# EAGLE design midicontroller (EAGLE 7.0.0)
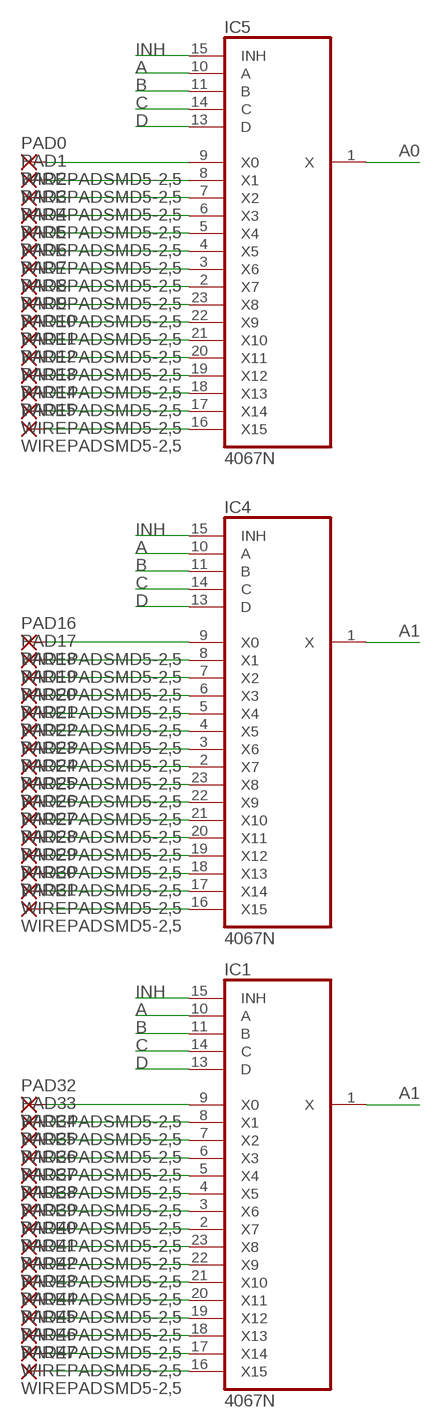
[diagram p0: schematic, sheet 1]

## Parts
IC1  4067N  [DIL24-6]
IC4  4067N  [DIL24-6]
IC5  4067N  [DIL24-6]
PAD0  WIREPADSMD5-2,5  [5-2,5]
PAD1  WIREPADSMD5-2,5  [5-2,5]
PAD2  WIREPADSMD5-2,5  [5-2,5]
PAD3  WIREPADSMD5-2,5  [5-2,5]
PAD4  WIREPADSMD5-2,5  [5-2,5]
PAD5  WIREPADSMD5-2,5  [5-2,5]
PAD6  WIREPADSMD5-2,5  [5-2,5]
PAD7  WIREPADSMD5-2,5  [5-2,5]
PAD8  WIREPADSMD5-2,5  [5-2,5]
PAD9  WIREPADSMD5-2,5  [5-2,5]
PAD10  WIREPADSMD5-2,5  [5-2,5]
PAD11  WIREPADSMD5-2,5  [5-2,5]
PAD12  WIREPADSMD5-2,5  [5-2,5]
PAD13  WIREPADSMD5-2,5  [5-2,5]
PAD14  WIREPADSMD5-2,5  [5-2,5]
PAD15  WIREPADSMD5-2,5  [5-2,5]
PAD16  WIREPADSMD5-2,5  [5-2,5]
PAD17  WIREPADSMD5-2,5  [5-2,5]
PAD18  WIREPADSMD5-2,5  [5-2,5]
PAD19  WIREPADSMD5-2,5  [5-2,5]
PAD20  WIREPADSMD5-2,5  [5-2,5]
PAD21  WIREPADSMD5-2,5  [5-2,5]
PAD22  WIREPADSMD5-2,5  [5-2,5]
PAD23  WIREPADSMD5-2,5  [5-2,5]
PAD24  WIREPADSMD5-2,5  [5-2,5]
PAD25  WIREPADSMD5-2,5  [5-2,5]
PAD26  WIREPADSMD5-2,5  [5-2,5]
PAD27  WIREPADSMD5-2,5  [5-2,5]
PAD28  WIREPADSMD5-2,5  [5-2,5]
PAD29  WIREPADSMD5-2,5  [5-2,5]
PAD30  WIREPADSMD5-2,5  [5-2,5]
PAD31  WIREPADSMD5-2,5  [5-2,5]
PAD32  WIREPADSMD5-2,5  [5-2,5]
PAD33  WIREPADSMD5-2,5  [5-2,5]
PAD34  WIREPADSMD5-2,5  [5-2,5]
PAD35  WIREPADSMD5-2,5  [5-2,5]
PAD36  WIREPADSMD5-2,5  [5-2,5]
PAD37  WIREPADSMD5-2,5  [5-2,5]
PAD38  WIREPADSMD5-2,5  [5-2,5]
PAD39  WIREPADSMD5-2,5  [5-2,5]
PAD40  WIREPADSMD5-2,5  [5-2,5]
PAD41  WIREPADSMD5-2,5  [5-2,5]
PAD42  WIREPADSMD5-2,5  [5-2,5]
PAD43  WIREPADSMD5-2,5  [5-2,5]
PAD44  WIREPADSMD5-2,5  [5-2,5]
PAD45  WIREPADSMD5-2,5  [5-2,5]
PAD46  WIREPADSMD5-2,5  [5-2,5]
PAD47  WIREPADSMD5-2,5  [5-2,5]

## Nets
A: IC1.10(A) IC4.10(A) IC5.10(A)
A0: IC5.1(X)
A1: IC1.1(X) IC4.1(X)
B: IC1.11(B) IC4.11(B) IC5.11(B)
C: IC1.14(C) IC4.14(C) IC5.14(C)
D: IC1.13(D) IC4.13(D) IC5.13(D)
INH: IC1.15(INH) IC4.15(INH) IC5.15(INH)
N$1: IC5.8(X1) PAD1.1(P)
N$2: IC5.7(X2) PAD2.1(P)
N$3: IC5.6(X3) PAD3.1(P)
N$4: IC5.5(X4) PAD4.1(P)
N$5: IC5.4(X5) PAD5.1(P)
N$6: IC5.3(X6) PAD6.1(P)
N$7: IC5.2(X7) PAD7.1(P)
N$8: IC5.23(X8) PAD8.1(P)
N$9: IC5.22(X9) PAD9.1(P)
N$10: IC5.21(X10) PAD10.1(P)
N$11: IC5.20(X11) PAD11.1(P)
N$12: IC5.19(X12) PAD12.1(P)
N$13: IC5.18(X13) PAD13.1(P)
N$14: IC5.17(X14) PAD14.1(P)
N$15: IC5.16(X15) PAD15.1(P)
N$16: IC4.9(X0) PAD16.1(P)
N$17: IC4.8(X1) PAD17.1(P)
N$18: IC4.7(X2) PAD18.1(P)
N$19: IC4.6(X3) PAD19.1(P)
N$20: IC4.5(X4) PAD20.1(P)
N$21: IC4.4(X5) PAD21.1(P)
N$22: IC4.3(X6) PAD22.1(P)
N$23: IC4.2(X7) PAD23.1(P)
N$24: IC4.23(X8) PAD24.1(P)
N$25: IC4.22(X9) PAD25.1(P)
N$26: IC4.21(X10) PAD26.1(P)
N$27: IC4.20(X11) PAD27.1(P)
N$28: IC4.19(X12) PAD28.1(P)
N$29: IC4.18(X13) PAD29.1(P)
N$30: IC4.17(X14) PAD30.1(P)
N$31: IC4.16(X15) PAD31.1(P)
N$32: IC1.9(X0) PAD32.1(P)
N$33: IC1.8(X1) PAD33.1(P)
N$34: IC1.7(X2) PAD34.1(P)
N$35: IC1.6(X3) PAD35.1(P)
N$36: IC1.5(X4) PAD36.1(P)
N$37: IC1.4(X5) PAD37.1(P)
N$38: IC1.3(X6) PAD38.1(P)
N$39: IC1.2(X7) PAD39.1(P)
N$40: IC1.23(X8) PAD40.1(P)
N$41: IC1.22(X9) PAD41.1(P)
N$42: IC1.21(X10) PAD42.1(P)
N$43: IC1.20(X11) PAD43.1(P)
N$44: IC1.19(X12) PAD44.1(P)
N$45: IC1.18(X13) PAD45.1(P)
N$46: IC1.17(X14) PAD46.1(P)
N$47: IC1.16(X15) PAD47.1(P)
N$79: IC5.9(X0) PAD0.1(P)

## Power pins joined to a net without a drawn wire
VDD: IC1.24(VDD) IC4.24(VDD) IC5.24(VDD)
VSS: IC1.12(VSS) IC4.12(VSS) IC5.12(VSS)

## Library data of the parts
IC1 IC4 IC5 = 40xx:4067: 16-channel ANALOG MULTIPLEXER
PAD0 PAD1-PAD47 = wirepad:WIREPAD: Wire PAD connect wire on PCB

## Board
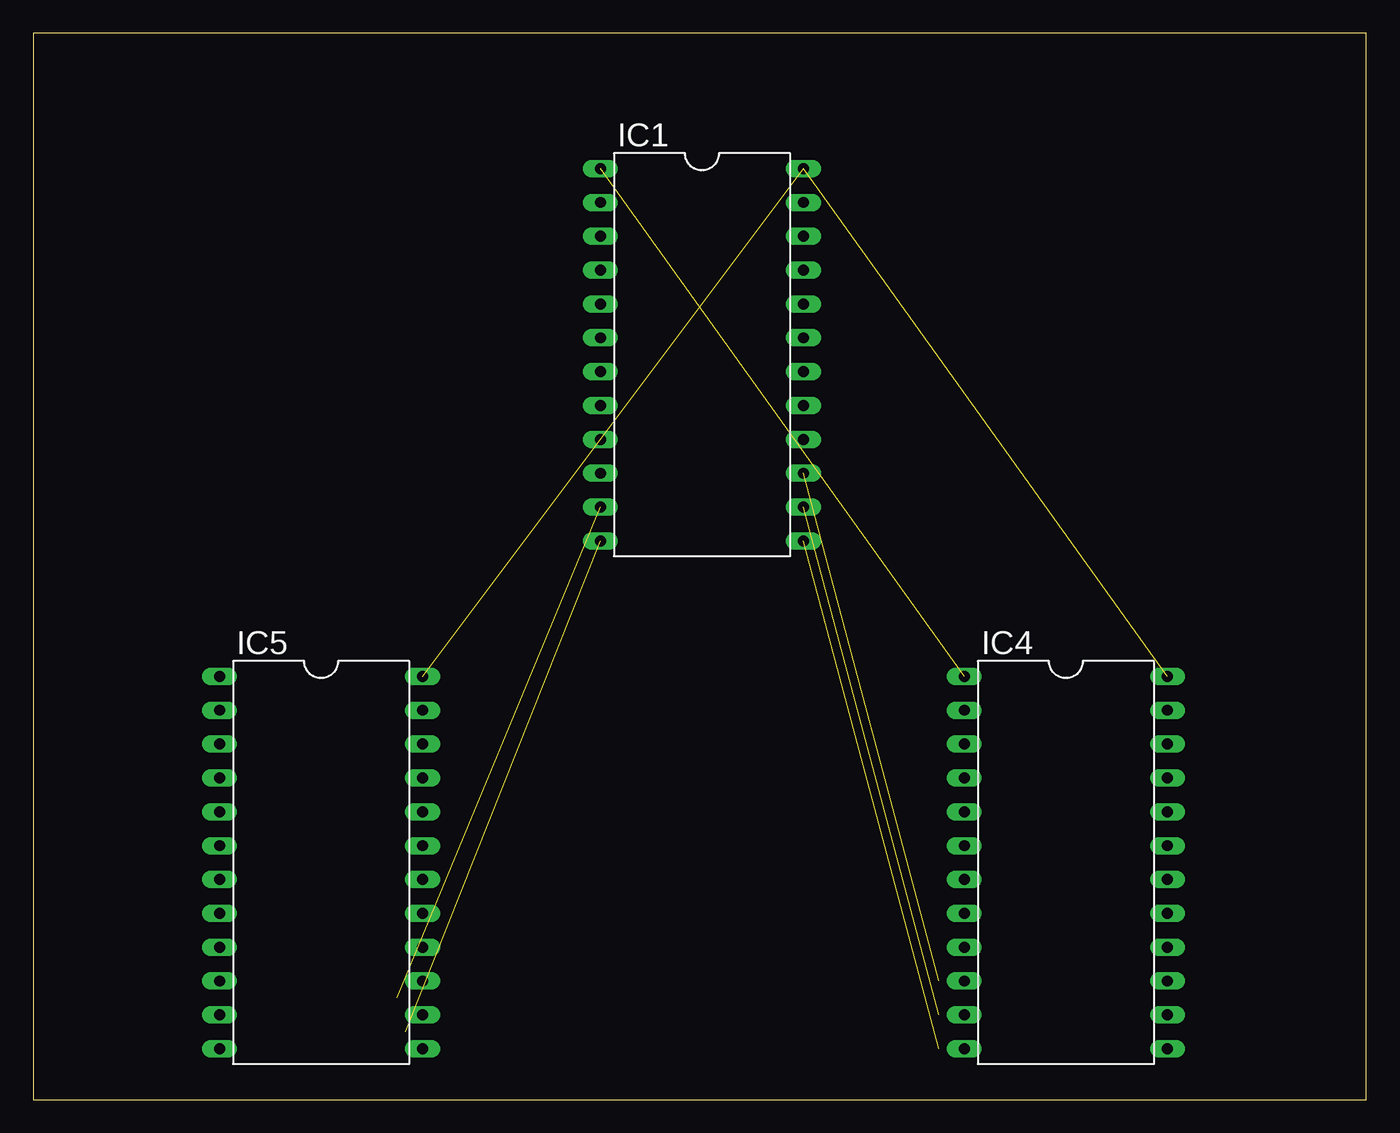
[diagram p1: board, top side]
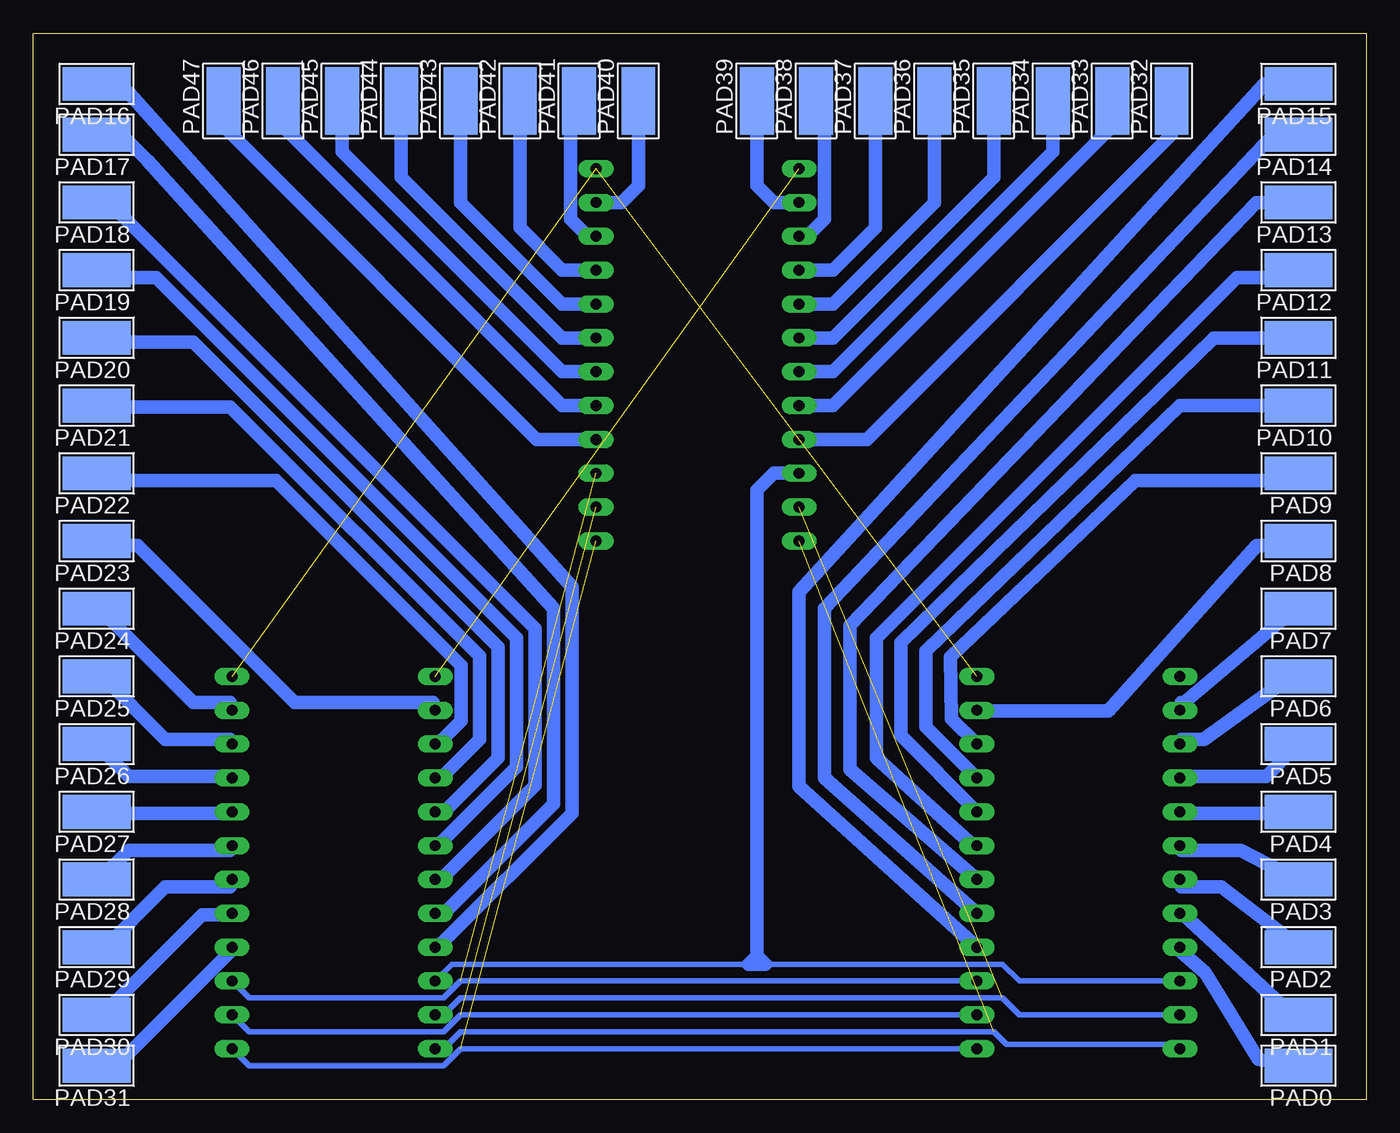
[diagram p2: board, bottom side, seen from below]

Size 100 x 80 mm. Coordinates in mm from the lower left corner, seen from the top.
Outline: 0,0 100,0 100,80 0,80 0,0
Copper layers (1*16): Top 0.035mm / dielectric 1.5mm / Bottom 0.035mm
Design rules "Tkkrlab-CNC": minimum track width 8mil, minimum drill 0.7mm, track to track 0.37mm, track to pad 0.37mm, pad to pad 0.37mm, via to via 0.37mm, smd to smd 0.37mm, copper to edge 20mil, drill to drill 8mil, minimum pad ring 10mil, minimum via ring 8mil, stop-mask expansion 4mil, vias tented up to drill 0mil, thermal gap 10mil

### Footprints (pad centres in the part's own frame; a part is rotated, then mirrored left to right if it is on the bottom)
DIL24-6 = drill 0.813 long: 1 -13.97,-7.62; 2 -11.43,-7.62; 3 -8.89,-7.62; 4 -6.35,-7.62; 5 -3.81,-7.62; 6 -1.27,-7.62; 7 1.27,-7.62; 8 3.81,-7.62; 9 6.35,-7.62; 10 8.89,-7.62; 11 11.43,-7.62; 12 13.97,-7.62; 13 13.97,7.62; 14 11.43,7.62; 15 8.89,7.62; 16 6.35,7.62; 17 3.81,7.62; 18 1.27,7.62; 19 -1.27,7.62; 20 -3.81,7.62; 21 -6.35,7.62; 22 -8.89,7.62; 23 -11.43,7.62; 24 -13.97,7.62
5-2,5 = smd 2.54 x 5.08: 1 0,0

### Placement (x,y rotation side)
IC1  50.16,55.88 270 top
IC4  77.47,17.78 270 top
IC5  21.59,17.78 270 top
PAD0  5.08,2.54 90 bottom
PAD1  5.08,6.35 90 bottom
PAD2  5.08,11.43 90 bottom
PAD3  5.08,16.51 90 bottom
PAD4  5.08,21.59 90 bottom
PAD5  5.08,26.67 90 bottom
PAD6  5.08,31.75 90 bottom
PAD7  5.08,36.83 90 bottom
PAD8  5.08,41.91 90 bottom
PAD9  5.08,46.99 90 bottom
PAD10  5.08,52.07 90 bottom
PAD11  5.08,57.15 90 bottom
PAD12  5.08,62.23 90 bottom
PAD13  5.08,67.31 90 bottom
PAD14  5.08,72.39 90 bottom
PAD15  5.08,76.2 90 bottom
PAD16  95.25,76.2 90 bottom
PAD17  95.25,72.39 90 bottom
PAD18  95.25,67.31 90 bottom
PAD19  95.25,62.23 90 bottom
PAD20  95.25,57.15 90 bottom
PAD21  95.25,52.07 90 bottom
PAD22  95.25,46.99 90 bottom
PAD23  95.25,41.91 90 bottom
PAD24  95.25,36.83 90 bottom
PAD25  95.25,31.75 90 bottom
PAD26  95.25,26.67 90 bottom
PAD27  95.25,21.59 90 bottom
PAD28  95.25,16.51 90 bottom
PAD29  95.25,11.43 90 bottom
PAD30  95.25,6.35 90 bottom
PAD31  95.25,2.54 90 bottom
PAD32  14.61,74.93 0 bottom
PAD33  19.05,74.93 0 bottom
PAD34  23.5,74.93 0 bottom
PAD35  27.94,74.93 0 bottom
PAD36  32.38,74.93 0 bottom
PAD37  36.83,74.93 0 bottom
PAD38  41.27,74.93 0 bottom
PAD39  45.72,74.93 0 bottom
PAD40  54.61,74.93 0 bottom
PAD41  59.05,74.93 0 bottom
PAD42  63.5,74.93 0 bottom
PAD43  67.94,74.93 0 bottom
PAD44  72.39,74.93 0 bottom
PAD45  76.83,74.93 0 bottom
PAD46  81.28,74.93 0 bottom
PAD47  85.72,74.93 0 bottom

### Tracks (layer width: path | path; a pad name or v marks a point on that pad's centre or on a via)
A
  Bottom 0.406: IC5.10 26.04,8.89 27.3,10.16 45.09,10.16 45.72,10.16 46.35,10.16 68.58,10.16 IC4.10
  Bottom 1.016: IC1.10 44.45,46.99 45.72,45.72 45.72,10.79 | 45.72,10.79 45.72,10.16 | 45.72,10.79 45.09,10.16 46.35,10.16 45.72,10.79
A1  (1 unrouted)
B  (1 unrouted)
  Bottom 0.406: IC4.11 69.22,6.35 67.94,7.62 27.3,7.62 26.04,6.35 IC5.11
C  (1 unrouted)
  Bottom 0.406: IC5.14 67.94,6.35 69.22,5.08 83.82,5.08 IC4.14
D  (1 unrouted)
  Bottom 0.406: IC4.13 83.82,2.54 69.22,2.54 67.94,3.81 IC5.13
INH  (1 unrouted)
  Bottom 0.406: IC4.15 83.82,7.62 69.22,7.62 67.94,8.89 IC5.15
N$1
  Bottom 1.016: IC5.8 13.86,13.86 13.69,13.86 5.43,6.24 PAD1.1
N$2
  Bottom 1.016: IC5.7 13.86,15.94 10.86,15.94 5.43,11.78 PAD2.1
N$3
  Bottom 1.016: IC5.6 13.86,18.71 9.41,18.71 5.43,16.63 PAD3.1
N$4
  Bottom 1.016: IC5.5 13.86,21.48 5.43,21.48 PAD4.1
N$5
  Bottom 1.016: IC5.4 13.86,24.25 7.51,24.25 5.43,26.33 PAD5.1
N$6
  Bottom 1.016: IC5.3 13.86,27.03 12.18,27.03 5.43,31.88 PAD6.1
N$7
  Bottom 1.016: IC5.2 13.86,29.8 13.63,29.8 5.43,36.73 PAD7.1
N$8
  Bottom 1.016: IC5.23 29.11,29.16 19.35,29.16 8.2,41.58 5.43,41.58 PAD8.1
N$9
  Bottom 1.016: PAD9.1 5.43,46.43 17.32,46.43 31.18,33.21 31.11,28.57 IC5.22
N$10
  Bottom 1.016: IC5.21 33.02,27.94 33.02,33.66 13.97,52.07 PAD10.1
N$11
  Bottom 1.016: IC5.20 34.92,27.3 34.92,34.29 11.43,57.15 PAD11.1
N$12
  Bottom 1.016: IC5.19 29.8,19.35 36.73,25.64 36.73,34.65 9.7,61.68 5.43,61.68 PAD12.1
N$13
  Bottom 1.016: IC5.18 38.73,24.77 38.73,35.56 8.26,67.31 PAD13.1
N$14
  Bottom 1.016: IC5.17 40.64,24.13 40.64,36.83 6.99,72.39 PAD14.1
N$15
  Bottom 1.016: IC5.16 42.55,23.5 42.55,38.1 7.62,76.2 PAD15.1
N$16
  Bottom 1.016: IC4.9 69.3,11.78 59.6,21.48 59.6,38.46 92.86,75.54 94.94,75.54 PAD16.1
N$17
  Bottom 1.016: IC4.8 69.3,13.86 60.98,22.18 60.98,36.84 91.44,70.48 93.03,72.07 94.94,72.07 PAD17.1
N$18
  Bottom 1.016: IC4.7 69.3,16.63 62.37,23.56 62.37,35.34 94.94,67.91 PAD18.1
N$19
  Bottom 1.016: IC4.6 69.3,19.4 63.76,24.95 63.76,34.65 90.78,61.68 94.94,61.68 PAD19.1
N$20
  Bottom 1.016: IC4.5 69.3,21.48 65.14,25.64 65.14,33.96 88.01,56.83 94.94,56.83 PAD20.1
N$21
  Bottom 1.016: IC4.4 69.3,24.25 66.53,27.03 66.53,33.26 85.24,51.98 94.94,51.98 PAD21.1
N$22
  Bottom 1.016: IC4.3 69.3,27.03 67.91,28.41 67.91,32.57 81.77,46.43 94.94,46.43 PAD22.1
N$23
  Bottom 1.016: IC4.2 69.99,29.8 80.39,29.8 92.17,41.58 94.94,41.58 PAD23.1
N$24
  Bottom 1.016: IC4.23 85.24,29.8 88.01,29.8 94.94,36.73 PAD24.1
N$25
  Bottom 1.016: IC4.22 85.24,27.03 90.09,27.03 94.94,31.88 PAD25.1
N$26
  Bottom 1.016: IC4.21 85.24,24.25 92.86,24.25 94.94,26.33 PAD26.1
N$27
  Bottom 1.016: IC4.20 85.24,21.48 94.94,21.48 PAD27.1
N$28
  Bottom 1.016: IC4.19 85.24,18.71 92.86,18.71 94.94,16.63 PAD28.1
N$29
  Bottom 1.016: IC4.18 85.24,15.94 90.09,15.94 94.94,11.09 PAD29.1
N$30
  Bottom 1.016: IC4.17 85.24,13.86 87.32,13.86 94.94,6.24 PAD30.1
N$31
  Bottom 1.016: IC4.16 85.24,11.09 93.56,2.77 94.94,2.77 PAD31.1
N$32
  Bottom 1.016: IC1.9 37.47,49.53 14.61,72.39 PAD32.1 14.61,75.56
N$33
  Bottom 1.016: IC1.8 40.01,52.07 19.05,73.03 PAD33.1
N$34
  Bottom 1.016: IC1.7 40.01,54.61 23.5,71.12 PAD34.1
N$35
  Bottom 1.016: IC1.6 40.01,57.15 27.94,69.22 PAD35.1
N$36
  Bottom 1.016: IC1.5 40.01,59.69 32.38,67.31 PAD36.1
N$37
  Bottom 1.016: IC1.4 40.01,62.23 36.83,65.41 PAD37.1
N$38
  Bottom 1.016: IC1.3 41.91,64.77 40.64,66.04 40.64,74.3 PAD38.1
N$39
  Bottom 1.016: IC1.2 44.45,67.31 45.72,68.58 PAD39.1
N$40
  Bottom 1.016: IC1.23 55.88,67.31 54.61,68.58 PAD40.1
N$41
  Bottom 1.016: IC1.22 58.42,64.77 59.69,66.04 59.69,74.3 PAD41.1
N$42
  Bottom 1.016: IC1.21 60.33,62.23 63.5,65.41 PAD42.1
N$43
  Bottom 1.016: IC1.20 60.33,59.69 67.94,67.31 PAD43.1
N$44
  Bottom 1.016: IC1.19 60.33,57.15 72.39,69.22 PAD44.1
N$45
  Bottom 1.016: IC1.18 60.33,54.61 76.83,71.12 PAD45.1
N$46
  Bottom 1.016: IC1.17 60.33,52.07 81.28,73.03 PAD46.1
N$47
  Bottom 1.016: IC1.16 62.23,49.53 85.72,73.03 PAD47.1
N$79
  Bottom 1.016: IC5.9 13.86,11.09 12.06,9.53 8.08,3 6.81,2.77 5.43,2.77 PAD0.1
VDD  (2 unrouted)
VSS  (1 unrouted)
  Bottom 0.381: 14.27,4.13 IC5.12
  Bottom 0.406: 14.27,4.13 26.99,4.13 27.94,5.08 67.94,5.08 69.22,3.81 IC4.12